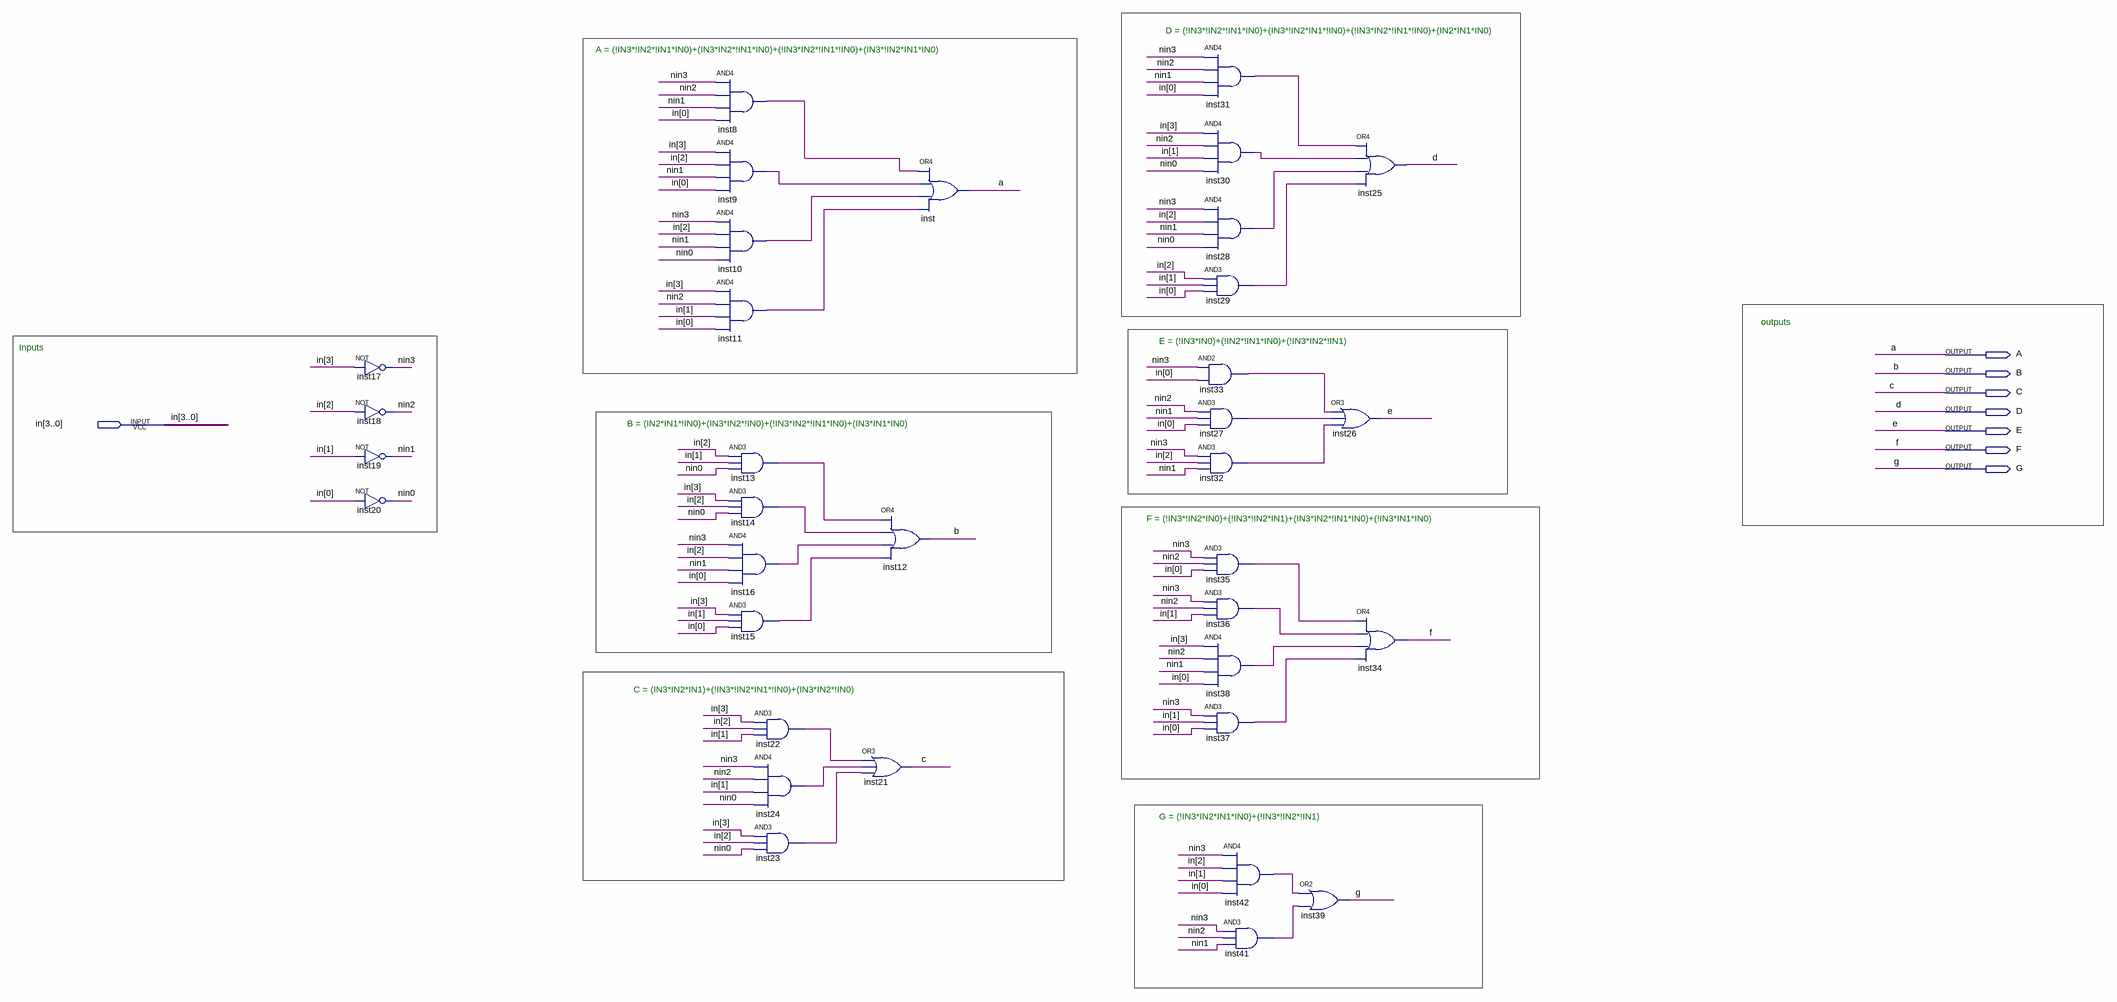
[diagram p0: schematic sheet]
// Quartus schematic display7segments.bdf as structural Verilog: 35 symbols, 8 pins
module display7segments (
  input  [3:0] in,
  output A,
  output B,
  output C,
  output D,
  output E,
  output F,
  output G
);

  wire inst8_out, inst9_out, inst10_out, inst11_out, inst13_out, inst14_out, inst15_out, inst16_out,
       inst22_out, inst23_out, inst24_out, inst27_out, inst28_out, inst29_out, inst30_out, inst31_out,
       inst32_out, inst33_out, inst35_out, inst36_out, inst37_out, inst38_out, inst41_out, inst42_out, nin0,
       nin1, nin2, nin3;

  not inst17 (nin3, in[3]);
  not inst18 (nin2, in[2]);
  not inst19 (nin1, in[1]);
  not inst20 (nin0, in[0]);
  and inst8 (inst8_out, nin3, nin2, nin1, in[0]);
  and inst9 (inst9_out, in[3], in[2], nin1, in[0]);
  and inst10 (inst10_out, nin3, in[2], nin1, nin0);
  and inst11 (inst11_out, in[3], nin2, in[1], in[0]);
  and inst13 (inst13_out, in[2], in[1], nin0);
  and inst14 (inst14_out, in[3], in[2], nin0);
  and inst16 (inst16_out, nin3, in[2], nin1, in[0]);
  and inst15 (inst15_out, in[3], in[1], in[0]);
  and inst22 (inst22_out, in[3], in[2], in[1]);
  and inst24 (inst24_out, nin3, nin2, in[1], nin0);
  and inst23 (inst23_out, in[3], in[2], nin0);
  or inst12 (B, inst13_out, inst14_out, inst16_out, inst15_out);
  or inst21 (C, inst22_out, inst24_out, inst23_out);
  or inst (A, inst8_out, inst9_out, inst10_out, inst11_out);
  and inst33 (inst33_out, nin3, in[0]);
  and inst27 (inst27_out, nin2, nin1, in[0]);
  and inst32 (inst32_out, nin3, in[2], nin1);
  and inst31 (inst31_out, nin3, nin2, nin1, in[0]);
  and inst30 (inst30_out, in[3], nin2, in[1], nin0);
  and inst28 (inst28_out, nin3, in[2], nin1, nin0);
  and inst29 (inst29_out, in[2], in[1], in[0]);
  and inst35 (inst35_out, nin3, nin2, in[0]);
  and inst36 (inst36_out, nin3, nin2, in[1]);
  and inst38 (inst38_out, in[3], nin2, nin1, in[0]);
  and inst37 (inst37_out, nin3, in[1], in[0]);
  and inst42 (inst42_out, nin3, in[2], in[1], in[0]);
  and inst41 (inst41_out, nin3, nin2, nin1);
  or inst39 (G, inst42_out, inst41_out);
  or inst26 (E, inst33_out, inst27_out, inst32_out);
  or inst25 (D, inst31_out, inst30_out, inst28_out, inst29_out);
  or inst34 (F, inst35_out, inst36_out, inst38_out, inst37_out);

  // Notes on the sheet:
  //   D = (!IN3*!IN2*!IN1*IN0)+(IN3*!IN2*IN1*!IN0)+(!IN3*IN2*!IN1*!IN0)+(IN2*IN1*IN0)
  //   A = (!IN3*!IN2*!IN1*IN0)+(IN3*IN2*!IN1*IN0)+(!IN3*IN2*!IN1*!IN0)+(IN3*!IN2*IN1*IN0)
  //   outputs
  //   E = (!IN3*IN0)+(!IN2*!IN1*IN0)+(!IN3*IN2*!IN1)
  //   Inputs
  //   B = (IN2*IN1*!IN0)+(IN3*IN2*!IN0)+(!IN3*IN2*!IN1*IN0)+(IN3*IN1*IN0)
  //   F = (!IN3*!IN2*IN0)+(!IN3*!IN2*IN1)+(IN3*IN2*!IN1*IN0)+(!IN3*IN1*IN0)
  //   C = (IN3*IN2*IN1)+(!IN3*!IN2*IN1*!IN0)+(IN3*IN2*!IN0)
  //   G = (!IN3*IN2*IN1*IN0)+(!IN3*!IN2*!IN1)
endmodule
